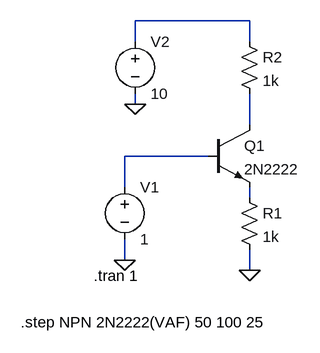
[diagram p0: schematic PCF_test3.asc]
PCF_test3.asc, the LTspice schematic file:
Version 4
SHEET 1 880 680
WIRE 272 -112 96 -112
WIRE 96 -80 96 -112
WIRE 272 -80 272 -112
WIRE 96 16 96 0
WIRE 272 48 272 0
WIRE 208 96 80 96
WIRE 80 144 80 96
WIRE 272 160 272 144
WIRE 80 256 80 224
WIRE 272 272 272 240
FLAG 80 256 0
FLAG 272 272 0
FLAG 96 16 0
SYMBOL voltage 80 128 R0
SYMATTR InstName V1
SYMATTR Value 1
SYMBOL npn 208 48 R0
SYMATTR InstName Q1
SYMATTR Value 2N2222
SYMBOL res 256 144 R0
SYMATTR InstName R1
SYMATTR Value 1k
SYMBOL res 256 -96 R0
SYMATTR InstName R2
SYMATTR Value 1k
SYMBOL voltage 96 -96 R0
WINDOW 123 0 0 Left 2
WINDOW 39 0 0 Left 2
SYMATTR InstName V2
SYMATTR Value 10
TEXT 32 280 Left 2 !.tran 1
TEXT -80 352 Left 2 !.step NPN 2N2222(VAF) 50 100 25

The netlist it stands for:
* PCF_test3.asc
V1 N003 0 1
Q1 N002 N003 N004 0 2N2222
R1 N004 0 1k
R2 N001 N002 1k
V2 N001 0 10
.model NPN NPN
.model PNP PNP
.lib standard.bjt
.tran 1
.step NPN 2N2222(VAF) 50 100 25
.backanno
.end